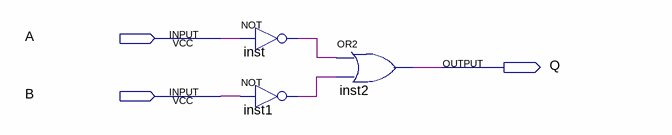
[diagram p0: schematic sheet]
// Quartus schematic TopRight.bdf as structural Verilog: 3 symbols, 3 pins
module TopRight (
  input  A,
  input  B,
  output Q
);

  wire inst1_out, inst_out;

  not inst (inst_out, A);
  not inst1 (inst1_out, B);
  or inst2 (Q, inst_out, inst1_out);
endmodule
